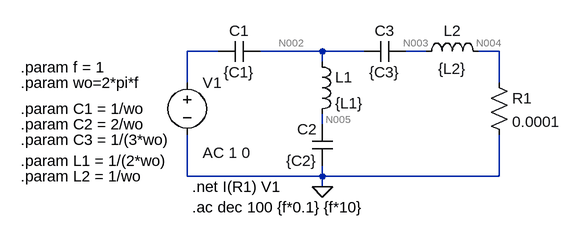
[diagram p0: schematic EJ1.asc]
EJ1.asc, the LTspice schematic file:
Version 4
SHEET 1 880 680
WIRE 32 80 -16 80
WIRE 192 80 96 80
WIRE 256 80 192 80
WIRE 352 80 320 80
WIRE 464 80 432 80
WIRE 192 96 192 80
WIRE -16 128 -16 80
WIRE 464 128 464 80
WIRE 192 192 192 176
WIRE -16 272 -16 208
WIRE 192 272 192 256
WIRE 192 272 -16 272
WIRE 464 272 464 208
WIRE 464 272 192 272
WIRE 192 288 192 272
FLAG 192 288 0
SYMBOL cap 96 64 R90
WINDOW 0 0 32 VBottom 2
WINDOW 3 32 32 VTop 2
SYMATTR InstName C1
SYMATTR Value {C1}
SYMBOL cap 208 256 R180
WINDOW 0 24 56 Left 2
WINDOW 3 24 8 Left 2
SYMATTR InstName C2
SYMATTR Value {C2}
SYMBOL ind 176 80 R0
SYMATTR InstName L1
SYMATTR Value {L1}
SYMBOL cap 320 64 R90
WINDOW 0 0 32 VBottom 2
WINDOW 3 32 32 VTop 2
SYMATTR InstName C3
SYMATTR Value {C3}
SYMBOL ind 336 96 R270
WINDOW 0 32 56 VTop 2
WINDOW 3 5 56 VBottom 2
SYMATTR InstName L2
SYMATTR Value {L2}
SYMBOL voltage -16 112 R0
WINDOW 123 24 124 Left 2
WINDOW 39 0 0 Left 0
SYMATTR InstName V1
SYMATTR Value ""
SYMATTR Value2 AC 1 0
SYMBOL res 448 112 R0
SYMATTR InstName R1
SYMATTR Value 0.0001
TEXT -272 216 Left 2 !.param C3 = 1/(3*wo)
TEXT -272 104 Left 2 !.param f = 1
TEXT -272 128 Left 2 !.param wo=2*pi*f
TEXT -8 320 Left 2 !.ac dec 100 {f*0.1} {f*10}
TEXT -8 288 Left 2 !.net I(R1) V1
TEXT -272 168 Left 2 !.param C1 = 1/wo
TEXT -272 192 Left 2 !.param C2 = 2/wo
TEXT -272 248 Left 2 !.param L1 = 1/(2*wo)
TEXT -272 272 Left 2 !.param L2 = 1/wo

The netlist it stands for:
* EJ1.asc
C1 N002 N001 {C1}
C2 0 N005 {C2}
L1 N002 N005 {L1}
C3 N003 N002 {C3}
L2 N003 N004 {L2}
V1 N001 0 AC 1 0
R1 N004 0 0.0001
.param C3 = 1/(3*wo)
.param f = 1
.param wo=2*pi*f
.ac dec 100 {f*0.1} {f*10}
.net I(R1) V1
.param C1 = 1/wo
.param C2 = 2/wo
.param L1 = 1/(2*wo)
.param L2 = 1/wo
.backanno
.end

* Results of the author's LTspice run, read from the files saved beside the schematic
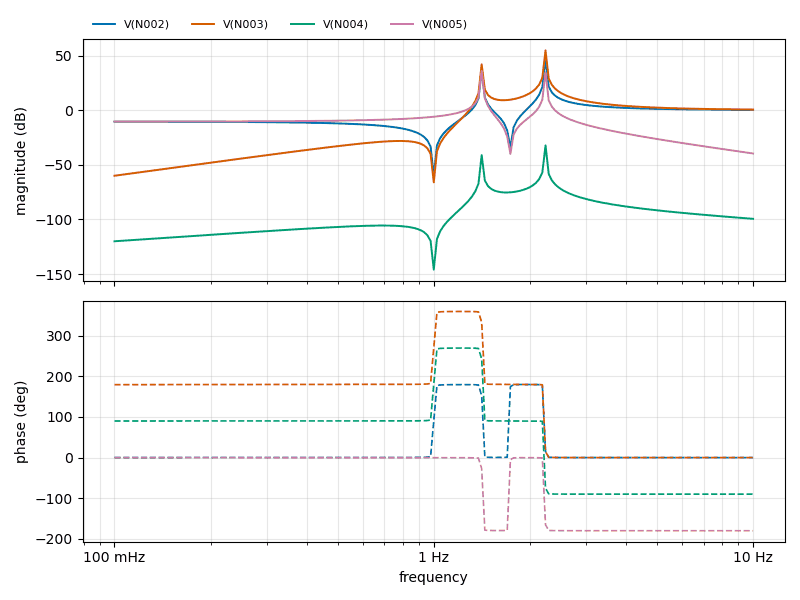
[diagram p1: AC Analysis of EJ1.asc, plotted from the saved traces]
* AC Analysis, 1 run:
*   V(N002): -10.51 dB at 100 mHz, 0.27 dB at 10 Hz, peak 46.78 dB at 2.239 Hz, 3 dB below the peak at 2.233 Hz and 2.245 Hz
*   V(N003): -60.03 dB at 100 mHz, 0.53 dB at 10 Hz, peak 54.71 dB at 2.239 Hz, 3 dB below the peak at 2.233 Hz and 2.245 Hz
*   V(N004): -120.03 dB at 100 mHz, -99.47 dB at 10 Hz, peak -32.29 dB at 2.239 Hz, 3 dB below the peak at 2.232 Hz and 2.245 Hz
*   V(N005): -10.43 dB at 100 mHz, -39.64 dB at 10 Hz, peak 35.98 dB at 1.413 Hz, 3 dB below the peak at 1.409 Hz and 1.416 Hz